# EAGLE design tracker4 (EAGLE 6.5.0)
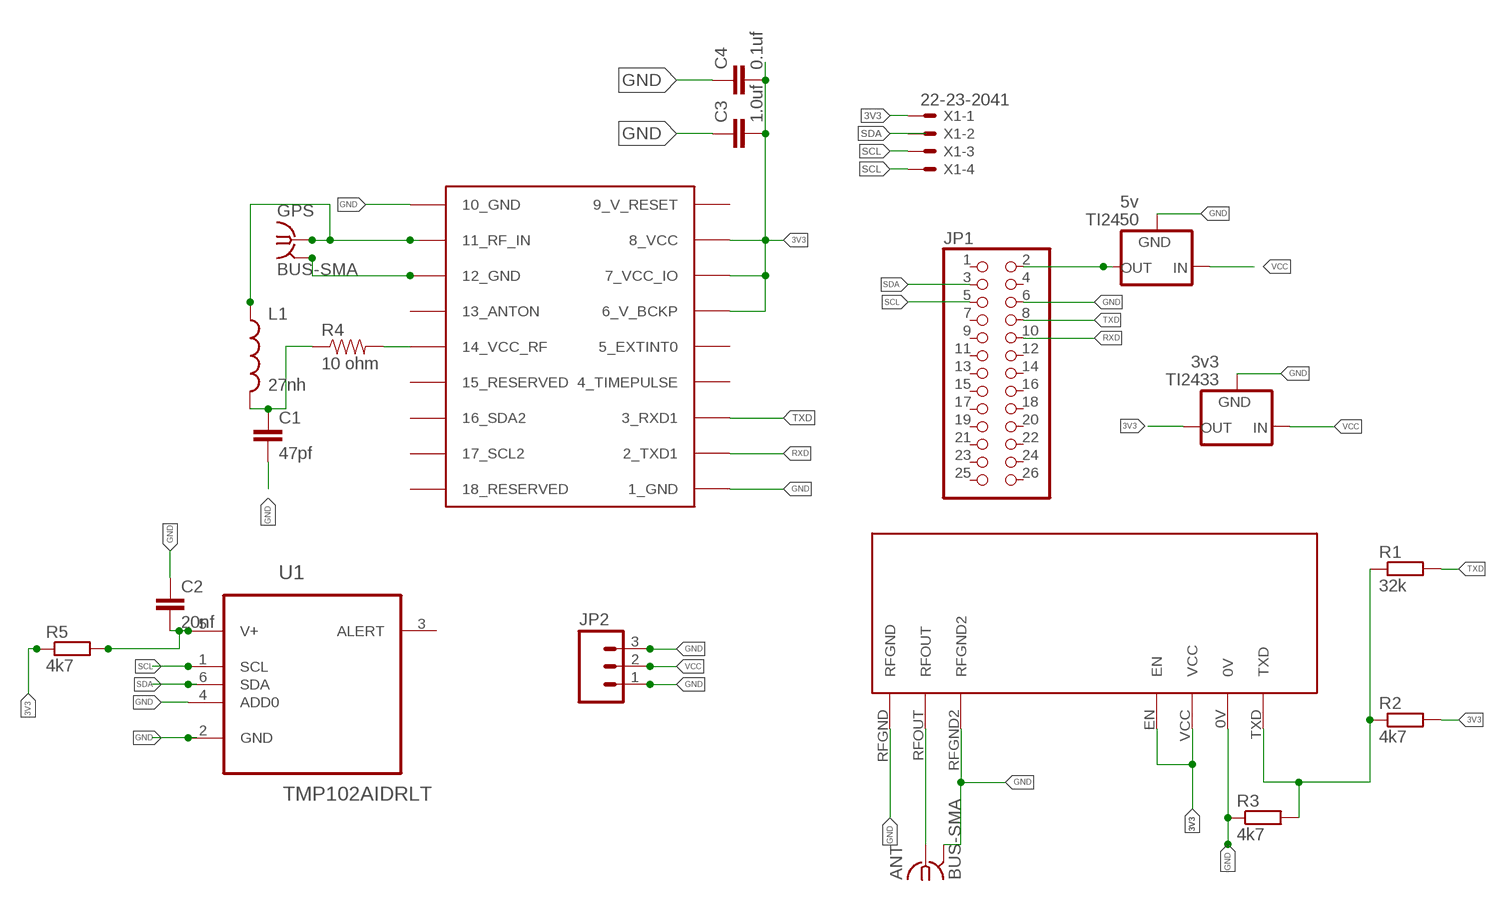
[diagram p0: schematic, sheet 1]

## Parts
ANT  BUS-SMA  [BUS-SMA]
C1  47pf  CAP0603-CAP  [0603-CAP]
C2  20nf  C-EUC0603  [C0603]
C3  1.0uf  C-EUC0603  [C0603]
C4  0.1uf  C-EUC0603  [C0603]
GPS  BUS-SMA  [BUS-SMA]
JP1  PINHD-2X13  [2X13]
JP2  M03PTH  [1X03]
L1  27nh  INDUCTOR0603  [0603]
R1  32k  R-EU_R0603  [R0603]
R2  4k7  R-EU_R0603  [R0603]
R3  4k7  R-EU_R0603  [R0603]
R4  10 ohm  RESISTOR0603  [0603-RES]
R5  4k7  R-EU_R0603  [R0603]
TI2433  3v3  V_REG_78XX-TO-220  [TO-220-ALT]
TI2450  5v  V_REG_78XX-TO-220  [TO-220-ALT]
U1  TMP102AIDRLT  [SOT50P160X60-6N]
U$1  NTX2  [NTX2]
U$2  UBLOX_MAX  [UBLOX_MAX]
X1  22-23-2041  [22-23-2041]

## Nets
3V3: C2.2 C3.2 C4.2 R2.2 R5.1 R5.2 TI2433.OUT U1.5(V+) U$1.EN U$1.VCC U$2.6_V_BCKP U$2.7_VCC_IO U$2.8_VCC X1.1
GND: ANT.2(GND) ANT.3(GND) ANT.4(GND) ANT.5(GND) C1.2 C2.1 C3.1 C4.1 GPS.2(GND) GPS.3(GND) GPS.4(GND) GPS.5(GND) JP1.6 JP2.1 JP2.3 R3.1 TI2433.GND TI2450.GND U1.2(GND) U1.4(ADD0) U$1.0V U$1.RFGND U$1.RFGND2 U$2.1_GND U$2.10_GND U$2.12_GND X1.4
N$1: JP1.2 TI2450.OUT
N$2: R4.2 U$2.14_VCC_RF
N$3: C1.1 L1.2 R4.1
N$6: R1.1 R2.1 R3.2 U$1.TXD
N$9: ANT.1 U$1.RFOUT
N$13: GPS.1 L1.1 U$2.11_RF_IN
RXD: JP1.10 U$2.2_TXD1
SCL: JP1.5 U1.1(SCL) X1.3
SDA: JP1.3 U1.6(SDA) X1.2
TXD: JP1.8 R1.2 U$2.3_RXD1
VCC: JP2.2 TI2433.IN TI2450.IN
Unconnected: JP1.1 JP1.4 JP1.7 JP1.9 JP1.11 JP1.12 JP1.13 JP1.14 JP1.15 JP1.16 JP1.17 JP1.18 JP1.19 JP1.20 JP1.21 JP1.22 JP1.23 JP1.24 JP1.25 JP1.26 U1.3(ALERT) U$2.4_TIMEPULSE U$2.5_EXTINT0 U$2.13_ANTON U$2.15_RESERVED U$2.16_SDA2 U$2.17_SCL2 U$2.18_RESERVED

## Power pins joined to a net without a drawn wire
9_V_RESET: U$2.9_V_RESET

## Library data of the parts
ANT GPS = Ava:BUS-SMA
C1 = SparkFun-Capacitors:CAP: Capacitor Standard 0603 ceramic capacitor, and 0.1" leaded capacitor.
C2-C4 = rcl:C-EU: CAPACITOR, European symbol
JP1 = pinhead:PINHD-2X13: PIN HEADER
JP2 = SparkFun-Connectors:M03: Header 3 Standard 3-pin 0.1" header. Use with straight break away headers (SKU : PRT-00116), right angle break away headers (PRT-00553), swiss pins (PRT-00743), machine pins (PRT-00117), and female headers (PRT-00115). Molex polarized connector foot print use with SKU : PRT-08232 with associated crimp pins and housings.
L1 = SparkFun-Passives:INDUCTOR: Inductors Basic Inductor/Choke - 0603 and 1206. Footprints are not proven and vary greatly between part numbers. SRN6045- 33uH, 20% 1.4A SDR0403-560KL - 56uH, 10%, 500mA RMS/740mA peak
R1-R3 R5 = rcl:R-EU_: RESISTOR, European symbol
R4 = SparkFun-Resistors:RESISTOR: Resistor Basic schematic elements and footprints for 0603, 1206, and PTH resistors.
TI2433 TI2450 = SparkFun-PowerIC:V_REG_78XX: Voltage Regulator Standard 7805 5V regulator. IGO (Input Ground Output). Spark Fun Electronics SKU : COM-00107
U1 = Ava:TMP102AIDRLT: Temperature Sensor; MPN: TMP102AIDRLT; OC_FARNELL: 1652477; OC_NEWARK: 53M3987; PACKAGE: SOT-23-6; SUPPLIER: Texas Instruments
U$1 = Ava:NTX2: Radiometrix NTX2 Transmitter Module Author Anthony Stirk / http://ava.upuaut.net
U$2 = Ava:UBLOX_MAX: UBLOX MAX
X1 = con-molex:22-23-2041: .100" (2.54mm) Center Header - 4 Pin; MF: MOLEX; MPN: 22-23-2041; OC_FARNELL: 1462920; OC_NEWARK: 38C0355

## Net classes
0 default: clearance 0.205 mm

## Board
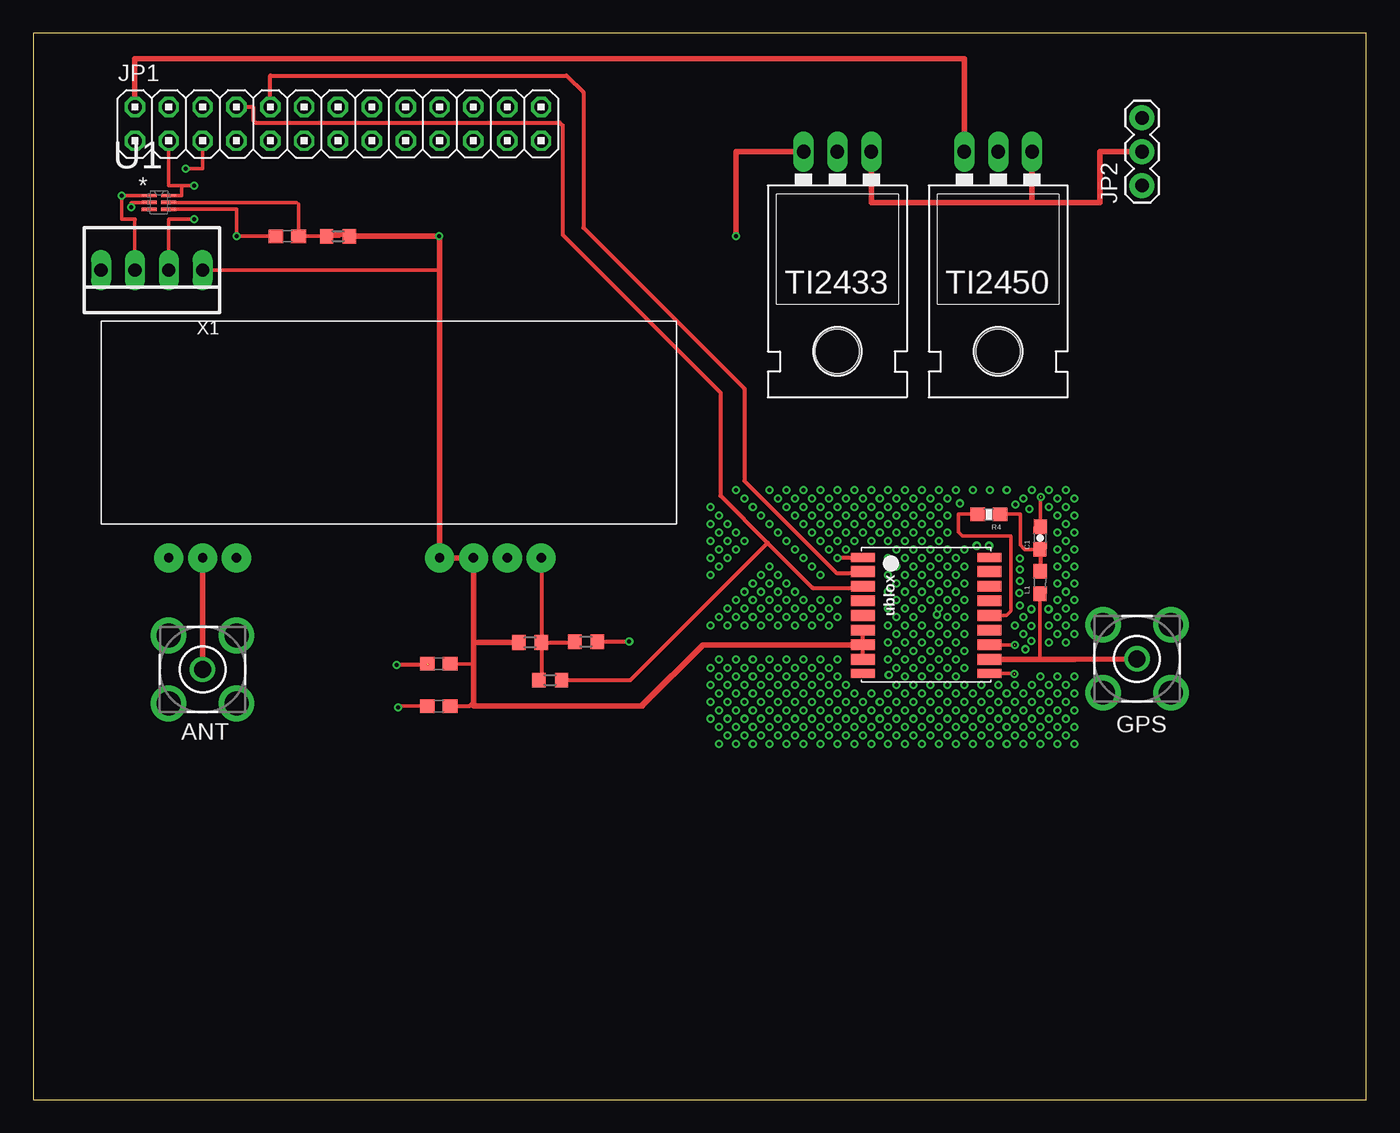
[diagram p1: board, top side]
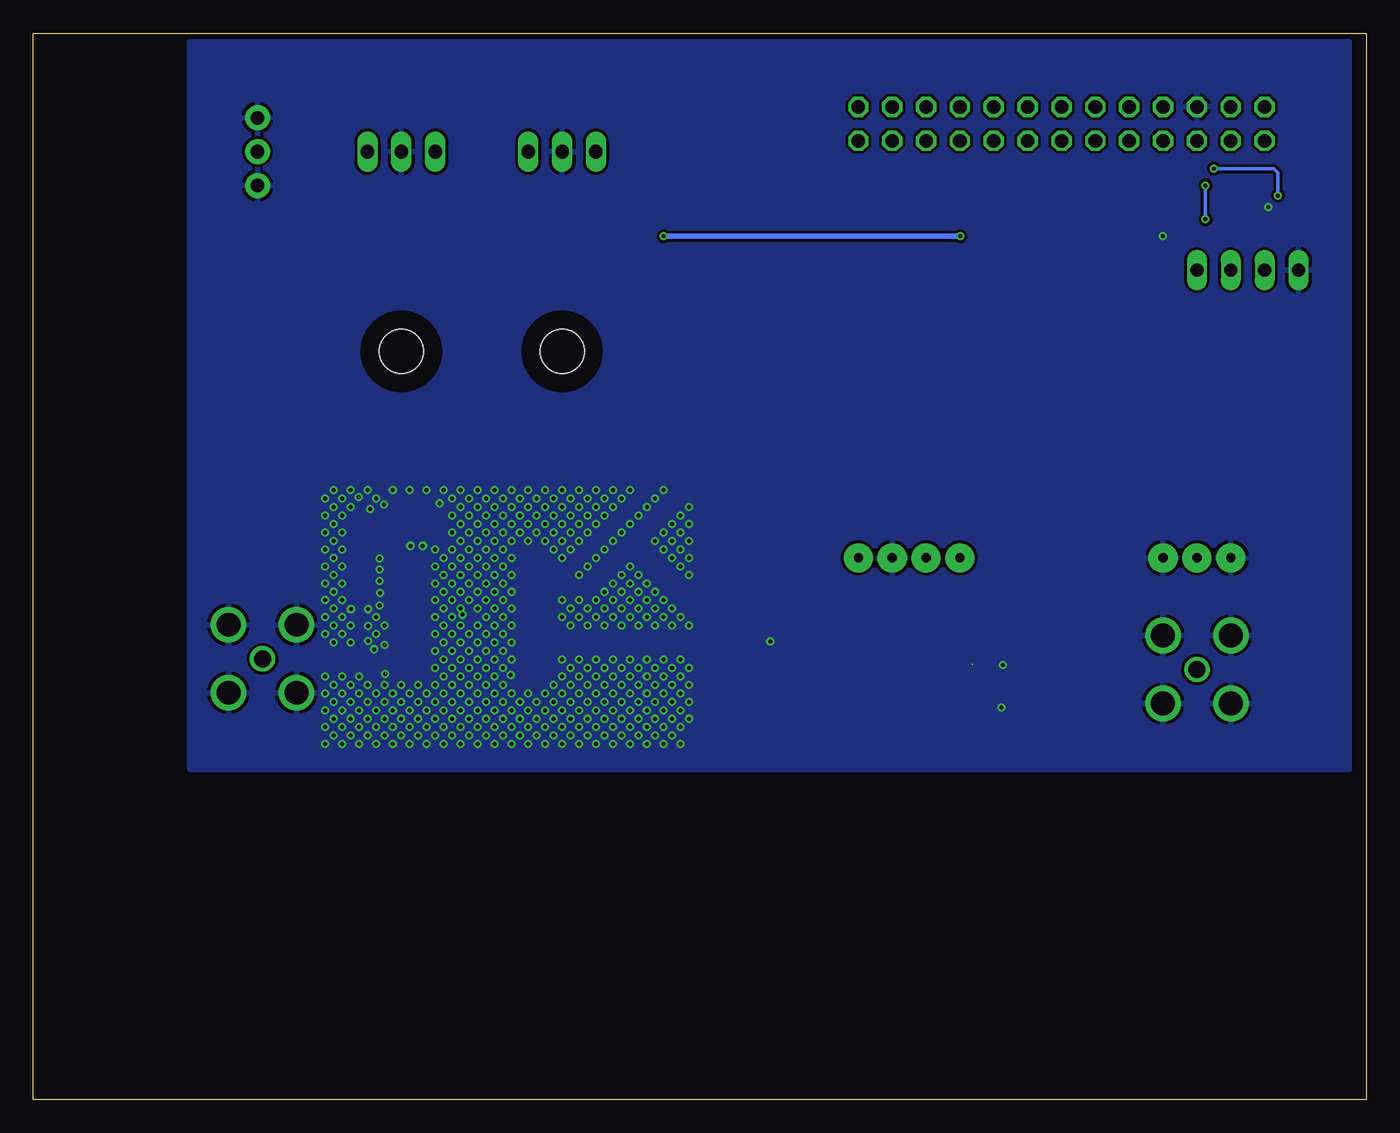
[diagram p2: board, bottom side, seen from below]

Size 100 x 80 mm. Coordinates in mm from the lower left corner, seen from the top.
Outline: 0,0 100,0 100,80 0,80 0,0
Copper layers (1*16): Top 0.035mm / dielectric 1.5mm / Bottom 0.035mm
Design rules "hackvana": minimum track width 6mil, minimum drill 0.3mm, track to track 6mil, track to pad 6mil, pad to pad 6mil, via to via 6mil, smd to smd 0mil, copper to edge 6mil, drill to drill 6mil, minimum pad ring 10mil, minimum via ring 6mil, stop-mask expansion 2mil, vias tented up to drill 100mil, thermal gap 10mil

### Footprints (pad centres in the part's own frame; a part is rotated, then mirrored left to right if it is on the bottom)
BUS-SMA = drill 1.27: 1 0,0 | drill 1.778: 2 -2.55,2.55; 3 2.55,2.55; 4 2.55,-2.55; 5 -2.55,-2.55
0603-CAP = smd 1.1 x 1: 1 -0.85,0; 2 0.85,0
C0603 = smd 1.1 x 1: 1 -0.85,0; 2 0.85,0
2X13 = drill 1.016 octagon: 1 -15.24,-1.27; 2 -15.24,1.27; 3 -12.7,-1.27; 4 -12.7,1.27; 5 -10.16,-1.27; 6 -10.16,1.27; 7 -7.62,-1.27; 8 -7.62,1.27; 9 -5.08,-1.27; 10 -5.08,1.27; 11 -2.54,-1.27; 12 -2.54,1.27; 13 0,-1.27; 14 0,1.27; 15 2.54,-1.27; 16 2.54,1.27; 17 5.08,-1.27; 18 5.08,1.27; 19 7.62,-1.27; 20 7.62,1.27; 21 10.16,-1.27; 22 10.16,1.27; 23 12.7,-1.27; 24 12.7,1.27; 25 15.24,-1.27; 26 15.24,1.27
1X03 = drill 1.016 pad 1.88: 1 0,0; 2 2.54,0; 3 5.08,0
0603 = smd 1.1 x 1: 1 -0.85,0; 2 0.85,0
R0603 = smd 1 x 1.1: 1 -0.85,0; 2 0.85,0
0603-RES = smd 1.1 x 1: 1 -0.85,0; 2 0.85,0
TO-220-ALT = drill 1.016 long: GND 0,-3.81; IN -2.54,-3.81; OUT 2.54,-3.81 | hole 3.302: 0,11.176
SOT50P160X60-6N = smd 1.118 x 0.254: 1 -0.737,0.508; 2 -0.737,0; 3 -0.737,-0.508; 4 0.737,-0.508; 5 0.737,0; 6 0.737,0.508
NTX2 = drill 0.7 pad 2.184: 0V -2.54,-10.16; EN -7.62,-10.16; RFGND -22.86,-10.16; RFGND2 -27.94,-10.16; RFOUT -25.4,-10.16; TXD 0,-10.16; VCC -5.08,-10.16
UBLOX_MAX = smd 1.8 x 0.7: 1_GND 4.95,-4.4; 9_V_RESET 4.95,4.3; 10_GND -4.55,4.3; 18_RESERVED -4.55,-4.4 | smd 1.8 x 0.8: 2_TXD1 4.95,-3.35; 3_RXD1 4.95,-2.25; 4_TIMEPULSE 4.95,-1.15; 5_EXTINT0 4.95,-0.05; 6_V_BCKP 4.95,1.05; 7_VCC_IO 4.95,2.15; 8_VCC 4.95,3.25; 11_RF_IN -4.55,3.25; 12_GND -4.55,2.15; 13_ANTON -4.55,1.05; 14_VCC_RF -4.55,-0.05; 15_RESERVED -4.55,-1.15; 16_SDA2 -4.55,-2.25; 17_SCL2 -4.55,-3.35
22-23-2041 = drill 1 long: 1 -3.81,0; 2 -1.27,0; 3 1.27,0; 4 3.81,0

### Placement (x,y rotation side)
ANT  12.7,32.27 0 top
C1  75.54,42.13 89.2 top
C2  19.05,64.77 0 top
C3  30.42,29.52 0 top
C4  30.42,32.69 0 top
GPS  82.8,33.07 0 top
JP1  22.86,73.21 0 top
JP2  83.19,68.58 90 top
L1  75.53,38.79 89.4 top
R1  38.78,31.47 0 top
R2  37.27,34.3 180 top
R3  41.46,34.36 180 top
R4  71.69,43.91 180 top
R5  22.86,64.77 0 top
TI2433  60.33,67.31 180 top
TI2450  72.39,67.31 180 top
U1  9.42,67.31 0 top
U$1  38.1,50.8 0 top
U$2  67.2,36.27 180 top
X1  8.89,62.23 180 top

### Tracks (layer width: path | path; a pad name or v marks a point on that pad's centre or on a via)
3V3  (via drill 0.3)
  Top 0.152: R5.2 R5.1
  Top 0.254: R5.1 23.28,65.09 22.96,64.77 C2.2 19.89,67.18 19.76,67.31 U1.5 | X1.1 30.48,62.23 | C4.2 33.05,32.69 33.05,32.38
  Top 0.305: U$2.6_V_BCKP U$2.7_VCC_IO U$2.8_VCC | R2.2 | C3.2 32.72,29.52 33.05,29.84
  Top 0.406: TI2433.OUT 52.7,71.12 v52.7,64.77 | R5.2 v30.45,64.77 30.48,64.74 30.48,62.23 U$1.EN U$1.VCC 33.02,35.56 | 36.25,34.12 R2.2 33.03,34.3 33.02,34.29 33.02,35.56 | U$2.7_VCC_IO 50.23,34.12 45.69,29.6 45.69,29.53 33.05,29.53 33.05,29.84 33.05,32.38 33.05,35.56 33.02,35.56
  Bottom 0.406: v52.7,64.77 v30.45,64.77
GND  (via drill 0.3)  (4 unrouted)
  Top 0.254: C2.1 v15.24,64.77 15.24,66.8 U1.4 | U$2.10_GND 73.58,31.97 | U$2.12_GND 71.78,34.09 73.61,34.09 | C1.2 75.55,45.21 75.58,45.24 | U1.2 7.34,67.31 v7.34,66.95 | C3.1 27.35,29.52 v27.35,29.43
  Top 0.305: R3.1 v44.71,34.35 | U$2.1_GND 62.21,40.64 v60.33,40.64 | 29.57,32.6 29.56,32.61 v27.27,32.61
  other vias: 73.61,31.94 73.63,34.09 75.61,45.19 64.18,31.86 64.14,33.02 64.14,34.29 64.14,35.56 64.14,36.83 64.14,38.1 64.14,39.37 64.14,40.64 64.14,41.91 64.14,43.18 64.14,44.45 64.14,45.72 65.41,45.72 65.41,44.45 65.41,43.18 65.41,41.91 65.41,40.64 65.41,39.37 65.41,38.1 65.41,36.83 65.41,35.56 65.41,34.29 65.41,33.02 65.41,31.75 65.41,30.48 65.41,29.21 65.41,27.94 64.14,27.94 64.14,29.21 64.14,30.48 62.87,30.48 62.87,29.21 62.87,27.94 61.59,27.94 61.59,29.21 61.59,30.48 66.67,27.94 66.67,29.21 66.67,30.48 66.67,31.75 66.67,33.02 66.67,34.29 66.67,35.56 66.67,36.83 66.67,38.1 66.67,39.37 66.67,40.64 66.67,41.91 66.67,43.18 66.67,44.45 66.67,45.72 67.94,27.94 67.94,29.21 67.94,30.48 67.94,31.75 67.94,33.02 67.94,34.29 67.94,35.56 67.94,36.83 67.94,38.1 67.94,39.37 67.94,40.64 67.94,41.91 67.94,43.18 67.94,44.45 67.94,45.72 62.87,41.91 62.87,43.18 62.87,44.45 62.87,45.72 61.59,41.91 61.59,43.18 61.59,44.45 61.59,45.72 69.22,27.94 69.22,29.21 69.22,30.48 69.22,31.75 69.22,33.02 69.22,34.29 69.22,35.56 69.22,36.83 69.22,38.1 69.22,39.37 69.22,40.64 69.22,45.72 70.48,27.94 70.48,29.21 70.48,30.48 71.75,27.94 71.75,29.21 71.75,30.48 73.03,27.94 73.03,29.21 73.03,30.48 74.3,27.94 74.3,29.21 75.56,27.94 75.56,29.21 73.66,35.56 74.3,34.92 74.3,36.2 74.3,45.09 70.48,45.72 71.75,45.72 73.03,45.72 77.47,38.1 77.47,39.37 77.47,40.64 77.47,41.91 77.47,43.18 77.47,44.45 77.47,45.72 76.83,27.94 69.85,36.2 69.85,37.47 69.85,38.73 69.85,40.01 69.85,34.92 69.85,33.66 69.85,32.38 68.58,32.38 68.58,33.66 68.58,34.92 68.58,36.2 68.58,37.47 68.58,38.73 68.58,40.01 67.31,40.01 67.31,38.73 67.31,37.47 67.79,36.38 67.31,34.92 67.31,33.66 67.31,32.38 66.04,32.38 66.04,33.66 66.04,34.92 66.04,36.2 66.04,37.47 66.04,38.73 66.04,40.01 64.77,32.38 64.77,33.66 64.77,34.92 64.77,36.2 64.77,37.47 64.77,38.73 64.77,40.01 63.5,28.57 62.23,28.57 64.77,28.57 66.04,28.57 67.31,28.57 68.58,28.57 69.85,28.57 71.12,28.57 72.39,28.57 73.66,28.57 74.93,28.57 76.2,28.57 74.93,29.84 73.66,29.84 72.39,29.84 71.12,29.84 69.85,29.84 68.58,29.84 67.31,29.84 66.04,29.84 64.77,29.84 63.5,29.84 62.23,29.84 64.77,31.11 66.04,31.11 67.31,31.11 68.58,31.11 69.85,31.11 71.12,31.11 72.39,31.11 62.23,42.55 63.5,42.55 64.77,42.55 66.04,42.55 67.31,42.55 68.58,42.55 68.58,43.81 67.31,43.81 66.04,43.81 64.77,43.81 63.5,43.81 62.23,43.81 62.23,45.09 63.5,45.09 64.77,45.09 66.04,45.09 67.31,45.09 68.58,45.09 74.93,45.72 76.83,45.09 69.85,41.27 64.77,41.27 66.04,41.27 67.31,41.27 68.58,41.27 60.96,28.57 60.96,29.84 60.96,31.11 60.96,42.55 60.96,43.81 60.96,45.09 60.96,27.3 62.23,27.3 63.5,27.3 64.77,27.3 66.04,27.3 67.31,27.3 68.58,27.3 69.85,27.3 71.12,27.3 72.39,27.3 73.66,27.3 74.93,27.3 76.2,27.3 76.83,26.67 75.56,26.67 74.3,26.67 73.03,26.67 71.75,26.67 70.48,26.67 69.22,26.67 67.94,26.67 66.67,26.67 65.41,26.67 64.14,26.67 62.87,26.67 61.59,26.67 74.42,33.79 74.88,35.53 74.02,37.05 73.99,37.99 74.02,38.9 74.02,39.76 74.02,40.6 71.71,41.55 70.78,41.55 69.51,44.74 74.75,44.31 73.69,44.63 74.88,36.79 74.88,34.4 76.2,44.45 76.83,43.81 76.83,41.27 76.83,42.55 76.83,40.01 76.83,38.73 76.83,37.47 76.17,36.79 74.3,30.48 73.66,31.11 76.83,29.21 76.2,29.84 76.83,30.48 75.56,30.48 74.93,31.11 76.2,31.11 76.83,31.75 75.56,31.75 76.2,35.56 76.83,36.2 76.83,34.92 76.2,34.29 77.47,36.83 77.47,35.56 77.47,34.29 78.11,34.92 78.11,36.2 78.11,37.47 78.11,38.73 78.11,40.01 78.11,41.27 78.11,42.55 78.11,43.81 78.11,45.09 76.2,45.72 77.47,27.3 78.11,26.67 78.11,27.94 78.11,29.21 78.11,30.48 78.11,31.75 77.47,31.11 77.47,29.84 77.47,28.57 60.33,30.48 60.33,26.67 60.33,27.94 60.33,29.21 60.33,31.75 60.33,33.02 59.69,27.3 59.69,28.57 59.69,29.84 59.69,31.11 59.69,32.38 59.05,30.48 59.05,29.21 59.05,31.75 59.05,33.02 59.05,27.94 59.05,26.67 58.42,27.3 58.42,28.57 58.42,29.84 58.42,31.11 58.42,32.38 57.78,33.02 57.78,31.75 57.78,30.48 57.78,29.21 57.78,27.94 57.78,26.67 60.33,45.72 60.33,44.45 60.33,43.18 60.33,41.91 59.05,41.91 57.78,43.18 56.52,44.45 55.24,45.72 57.15,43.81 55.88,45.09 58.42,42.55 59.69,41.27 59.69,42.55 59.05,43.18 58.42,43.81 57.78,44.45 57.15,45.09 56.52,45.72 59.05,44.45 58.42,45.09 57.78,45.72 59.05,45.72 59.69,45.09 59.69,43.81 60.96,41.27 53.34,45.09 53.98,44.45 52.7,45.72 54.61,43.81 55.24,43.18 55.88,42.55 56.52,41.91 57.15,41.27 57.78,40.64 58.42,40.01 59.05,39.37 50.8,44.45 51.44,43.81 52.07,43.18 52.7,42.55 53.34,41.91 55.24,40.01 55.88,39.37 56.52,38.73 57.15,38.1 57.78,37.47 59.05,37.47 60.33,37.47 50.8,43.18 50.8,41.91 50.8,40.64 50.8,39.37 51.44,42.55 51.44,41.27 51.44,40.01 52.07,40.64 52.7,41.27 52.07,41.91 54.61,39.37 53.98,38.73 53.34,38.1 52.7,37.47 52.07,36.83 51.44,36.2 50.8,35.56 52.07,35.56 52.7,36.2 53.34,36.83 53.98,37.47 54.61,38.1 55.24,38.73 53.34,35.56 54.61,35.56 55.88,35.56 57.15,35.56 58.42,35.56 59.69,35.56 56.52,37.47 55.88,36.83 55.24,36.2 56.52,36.2 57.15,36.83 58.42,36.83 57.78,36.2 59.05,36.2 59.69,36.83 60.33,36.2 55.88,38.1 55.24,37.47 54.61,36.83 53.98,36.2 56.52,33.02 55.24,33.02 53.98,33.02 52.7,33.02 51.44,33.02 56.52,31.75 55.24,31.75 53.98,31.75 52.7,31.75 51.44,31.75 51.44,30.48 52.7,30.48 53.98,30.48 55.24,30.48 56.52,30.48 56.52,29.21 55.24,29.21 53.98,29.21 52.7,29.21 51.44,29.21 51.44,27.94 52.7,27.94 53.98,27.94 55.24,27.94 56.52,27.94 56.52,26.67 55.24,26.67 53.98,26.67 52.7,26.67 51.44,26.67 57.15,32.38 55.88,32.38 54.61,32.38 53.34,32.38 52.07,32.38 52.07,31.11 52.07,29.84 52.07,28.57 52.07,27.3 53.34,27.3 53.34,28.57 53.34,29.84 53.34,31.11 54.61,31.11 55.88,31.11 57.15,31.11 57.15,29.84 55.88,29.84 54.61,29.84 54.61,28.57 55.88,28.57 57.15,28.57 57.15,27.3 55.88,27.3 54.61,27.3 50.8,32.38 50.8,31.11 50.8,29.84 50.8,28.57
  pour Bottom: 1.27,79.38 88.27,79.38 88.27,24.77 1.27,24.77
N$1
  Top 0.406: JP1.2 7.62,78.11 69.85,78.11 TI2450.OUT
N$2
  Top 0.254: R4.2 70.8,43.95 69.39,43.95 69.39,42.59 69.71,42.28 73.34,42.28 73.34,36.64 73.02,36.32 U$2.14_VCC_RF
N$3
  Top 0.254: R4.1 72.59,43.95 74.05,43.95 74.05,41.6 74.37,41.28 C1.1
  Top 0.305: C1.1 75.53,41.11 75.57,41.11 | 75.57,41.11 75.57,41.31 | 75.57,41.11 75.57,39.64 L1.2 | R4.1
N$6
  Top 0.305: R2.1 40.55,34.3 R3.2 | R2.1 38.12,31.66 R1.1 | U$1.TXD 38.12,40.62 R2.1
  Top 0.406: U$1.TXD
N$9
  Top 0.406: U$1.RFOUT ANT.1
N$13
  Top 0.254: 75.53,33.02 L1.1
  Top 0.305: 78.18,33.08 78.12,33.02 | 75.53,33.02 74.93,33.02
  Top 0.406: U$2.11_RF_IN 74.93,33.02 75.77,33.02 78.12,33.02 GPS.1
RXD
  Top 0.305: JP1.10 17.78,76.83 40.01,76.83 41.27,75.56 41.27,65.41 53.34,53.34 53.34,46.42 60.25,39.52 62.14,39.52 U$2.2_TXD1
SCL  (via drill 0.3)
  Top 0.254: JP1.5 12.7,69.85 v11.43,69.85 | U1.1 v6.62,67.82 6.64,67.82 6.64,66.07 7.63,66.07 7.63,66.03 7.62,66.03 X1.3
  Bottom 0.254: v11.43,69.85 6.94,69.85 6.62,69.53 v6.62,67.82
SDA  (via drill 0.3)
  Top 0.254: JP1.3 10.16,68.58 10.79,68.58 11.12,68.58 | 11.12,68.58 11.12,67.81 U1.6 | X1.2 10.16,66.04 v12.06,66.04 | v12.06,68.58 11.12,68.58
  Top 0.406: JP1.3
  Bottom 0.254: v12.06,66.04 v12.06,68.58
TXD
  Top 0.305: 62.14,38.42 U$2.3_RXD1 62.12,38.4 58.46,38.4 55.1,41.76 | R1.2 44.8,31.46 55.1,41.76 | JP1.8 16.45,74.48 16.51,74.42 16.51,73.45 16.66,73.3 39.49,73.3 39.72,73.08 39.72,64.89 51.55,53.06 51.55,45.32 55.1,41.76
  Top 0.406: 62.2,38.47 U$2.3_RXD1
VCC
  Top 0.406: JP2.2 80.01,71.12 80.01,67.31 74.93,67.31 | 74.93,67.31 TI2450.IN | TI2433.IN 62.87,67.31 74.93,67.31